# EAGLE schematic reference - MJ838 - base (EAGLE 9.6.2)
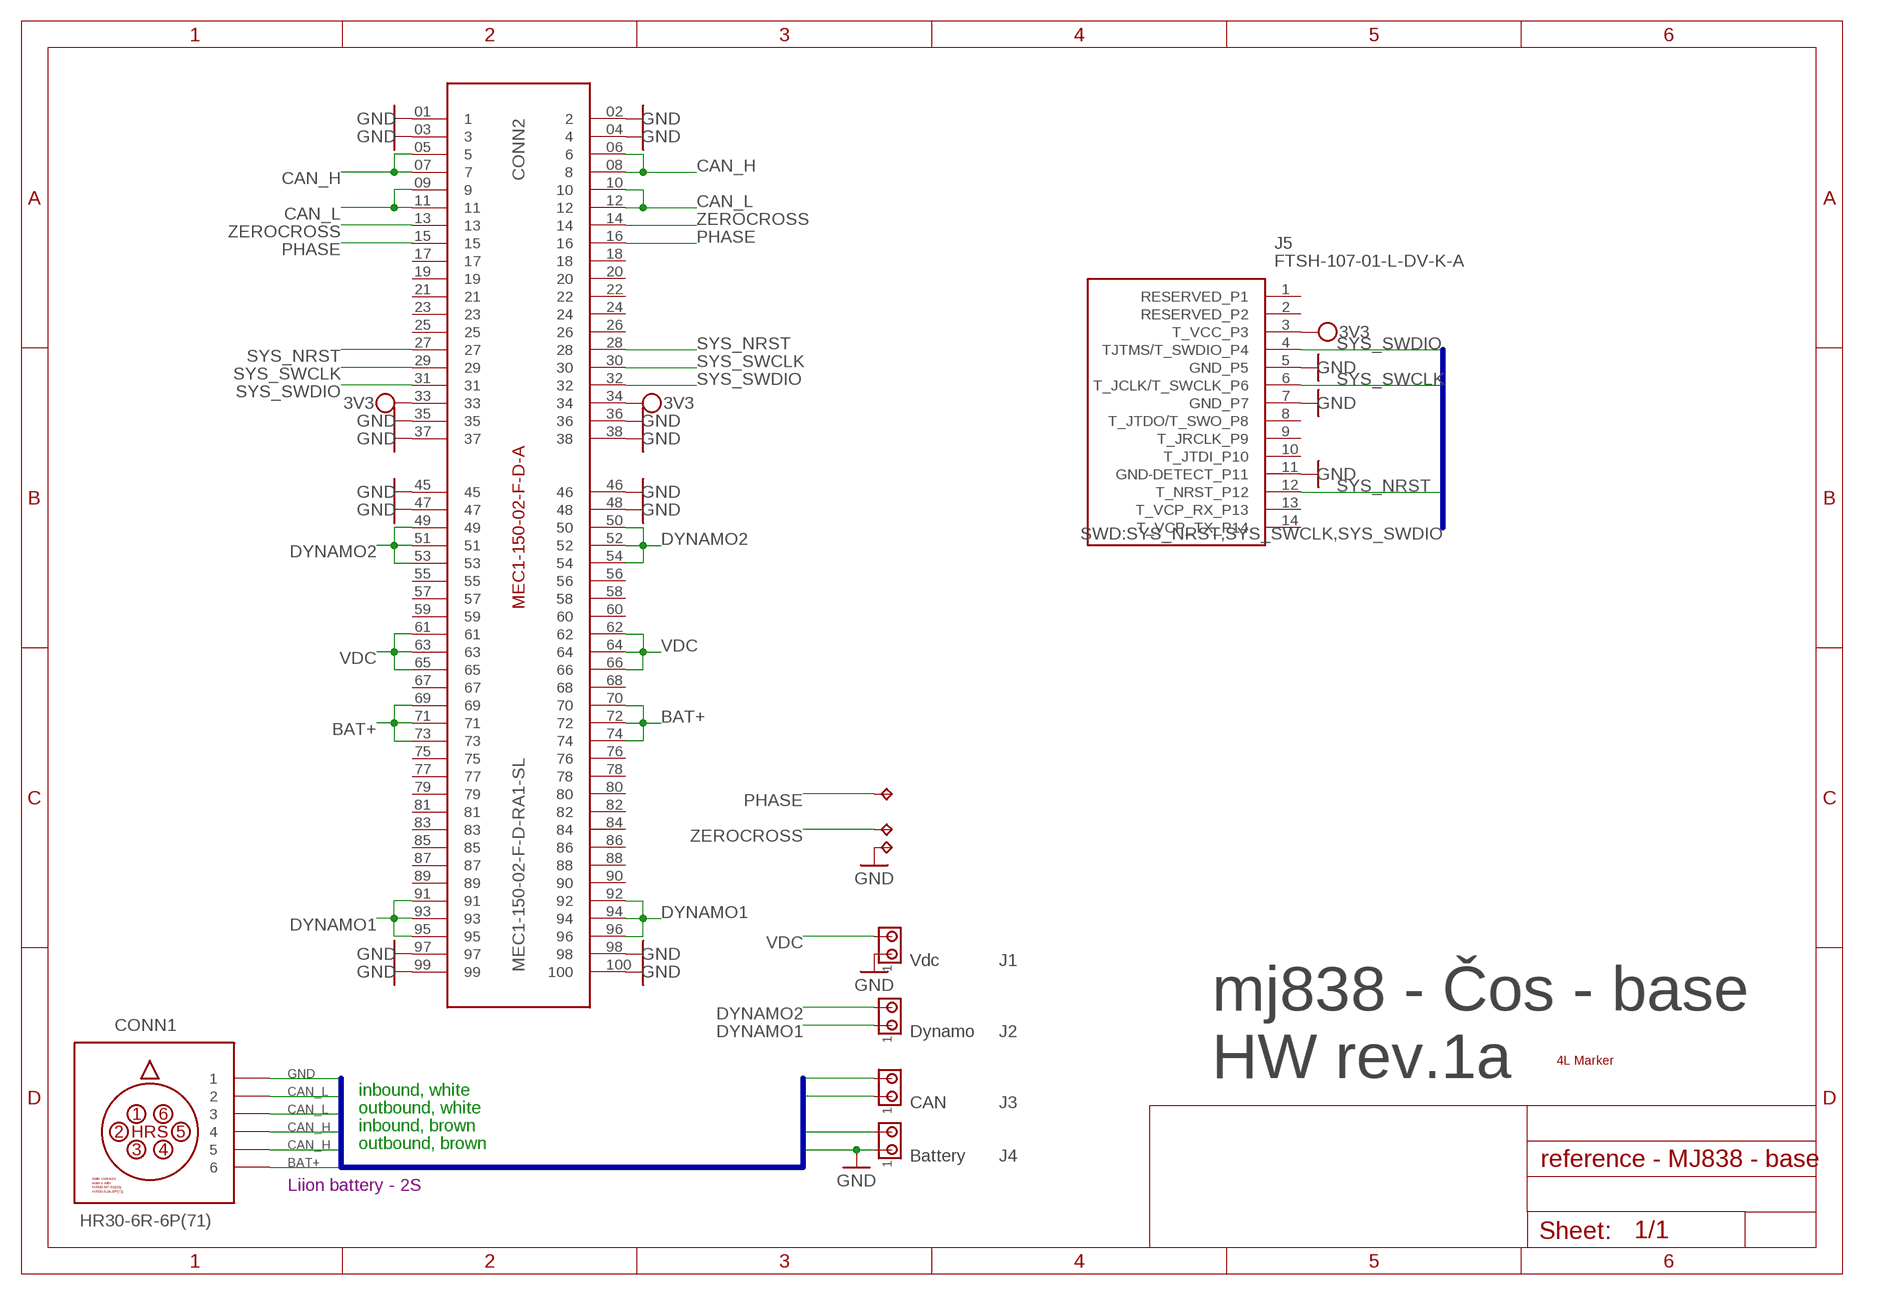
[diagram p0: schematic, sheet 1]

## Parts
CONN1  HR30-6R-6P(71)  HR-30-6R-6X  (no package)
CONN2  MEC1-150-02-F-D-RA1-SL  MEC1-150-2-F-D-RA  [SAMTEC_MEC1-150-2-F-D-RA1]
J1  Vdc  MTA02-100  [10X02MTA]
J2  Dynamo  MTA02-100  [10X02MTA]
J3  CAN  MTA02-100  [10X02MTA]
J4  Battery  MTA02-100  [10X02MTA]
J5  FTSH-107-01-L-DV-K-A  [FTSH10701LDVKA]
MARKER2  4 Layer marker  4L  [4L]
TP1  TPPAD1-13  [P1-13]
TP2  TPPAD1-13  [P1-13]
TP3  TPPAD1-13  [P1-13]

## Nets
3V3 [3V3]: CONN2.33 CONN2.34 J5.3(T_VCC_P3)
BAT+ [Vdc]: CONN1.6 CONN2.69 CONN2.70 CONN2.71 CONN2.72 CONN2.73 CONN2.74 J4.2
CAN_H [signal]: CONN1.4 CONN1.5 CONN2.05 CONN2.06 CONN2.07 CONN2.08 J3.2
CAN_L [signal]: CONN1.2 CONN1.3 CONN2.09 CONN2.10 CONN2.11 CONN2.12 J3.1
DYNAMO1 [Vac]: CONN2.91 CONN2.92 CONN2.93 CONN2.94 CONN2.95 CONN2.96 J2.1
DYNAMO2 [Vac]: CONN2.49 CONN2.50 CONN2.51 CONN2.52 CONN2.53 CONN2.54 J2.2
GND: CONN1.1 CONN2.01 CONN2.02 CONN2.03 CONN2.04 CONN2.35 CONN2.36 CONN2.37 CONN2.38 CONN2.45 CONN2.46 CONN2.47 CONN2.48 CONN2.97 CONN2.98 CONN2.99 CONN2.100 J1.1 J4.1 J5.5(GND_P5) J5.7(GND_P7) J5.11(GND-DETECT_P11) TP1.TP
PHASE: CONN2.15 CONN2.16 TP3.TP
SYS_NRST: CONN2.27 CONN2.28 J5.12(T_NRST_P12)
SYS_SWCLK [signal]: CONN2.29 CONN2.30 J5.6(T_JCLK/T_SWCLK_P6)
SYS_SWDIO [signal]: CONN2.31 CONN2.32 J5.4(TJTMS/T_SWDIO_P4)
VDC [Vdc]: CONN2.61 CONN2.62 CONN2.63 CONN2.64 CONN2.65 CONN2.66 J1.2
ZEROCROSS [signal]: CONN2.13 CONN2.14 TP2.TP
Unconnected: CONN2.17 CONN2.18 CONN2.19 CONN2.20 CONN2.21 CONN2.22 CONN2.23 CONN2.24 CONN2.25 CONN2.26 CONN2.55 CONN2.56 CONN2.57 CONN2.58 CONN2.59 CONN2.60 CONN2.67 CONN2.68 CONN2.75 CONN2.76 CONN2.77 CONN2.78 CONN2.79 CONN2.80 CONN2.81 CONN2.82 CONN2.83 CONN2.84 CONN2.85 CONN2.86 CONN2.87 CONN2.88 CONN2.89 CONN2.90 J5.1(RESERVED_P1) J5.2(RESERVED_P2) J5.8(T_JTDO/T_SWO_P8) J5.9(T_JRCLK_P9) J5.10(T_JTDI_P10) J5.13(T_VCP_RX_P13) J5.14(T_VCP_TX_P14)

## Buses
MJ8X8-BUS:BAT+,CAN_H,CAN_L,GND
SWD:SYS_NRST,SYS_SWCLK,SYS_SWDIO

## Notes on the sheet
- mj838 - Čos - base
  HW rev.1a
- inbound, white
- outbound, white
- inbound, brown
- outbound, brown
- Liion battery - 2S

## Library data of the parts
CONN1 = HR30-6R-6P - PushPull Receptacle:HR-30-6R-6X
CONN2 = Samtec MEC1 - Card Edge Connector:MEC1-150-2-F-D-RA
J1-J4 = con-amp:MTA02-100: AMP connector
J5 = STM32 JTAG 1.27mm 14pin header:FTSH-107-01-L-DV-K-A: Headers & Wire Housings .050" Micro Terminal Strip Source: Datasheet <https://componentsearchengine.com/Datasheets/1/FTSH-107-01-L-DV-K-A.pdf>; DESCRIPTION: Headers & Wire Housings .050" Micro Terminal Strip; HEIGHT: 5.97mm; MANUFACTURER_NAME: SAMTEC; MANUFACTURER_PART_NUMBER: FTSH-107-01-L-DV-K-A; MOUSER_PART_NUMBER: 200-FTSH10701LDVKA; MOUSER_PRICE-STOCK: https://www.mouser.com/Search/Refine.aspx?Keyword=200-FTSH10701LDVKA
MARKER2 = Layer Markers:4L
TP1-TP3 = testpad:TP: Test pad

## Net classes
0 GND: width 0.25 mm, drill 0.35 mm, clearance 0.19 mm
1 BAT+: width 0.5 mm, drill 0.35 mm, clearance 0.5 mm to class 0, clearance 0.5 mm
2 signal: width 0.25 mm, drill 0.35 mm, clearance 0.19 mm to class 0, clearance 0.19 mm to class 1, clearance 0.19 mm
3 3V3: width 0.25 mm, drill 0.35 mm, clearance 0.19 mm to class 0, clearance 0.19 mm to class 1, clearance 0.19 mm to class 2, clearance 0.19 mm
4 Vdc: width 0.5 mm, drill 0.35 mm, clearance 0.5 mm to class 0, clearance 0.5 mm to class 1, clearance 0.5 mm to class 2, clearance 0.5 mm to class 3, clearance 0.5 mm
5 Vdynamo: width 0.5 mm, drill 0.35 mm, clearance 0.5 mm to class 0, clearance 0.5 mm to class 1, clearance 0.5 mm to class 2, clearance 0.5 mm to class 3, clearance 0.5 mm to class 4, clearance 0.5 mm
6 Vac: width 0.5 mm, drill 0.35 mm, clearance 0.5 mm to class 0, clearance 0.5 mm to class 1, clearance 0.5 mm to class 2, clearance 0.5 mm to class 3, clearance 0.5 mm to class 4, clearance 0.5 mm to class 5, clearance 0.5 mm